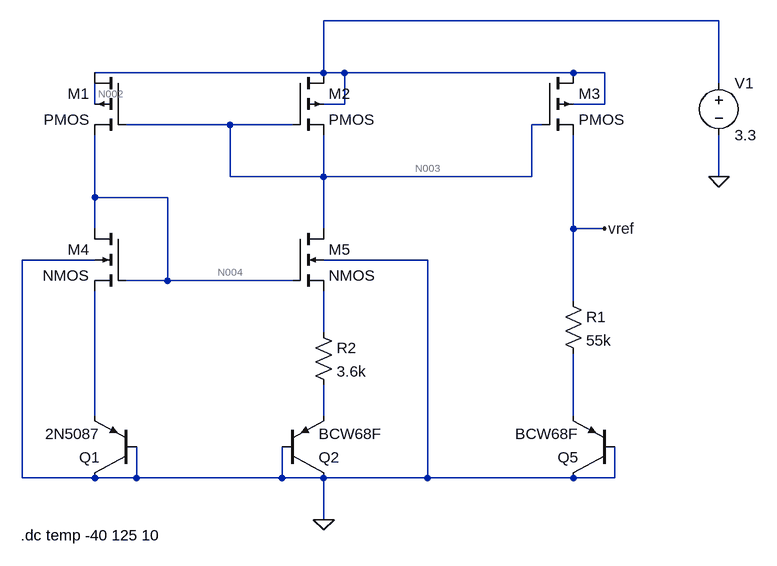
[diagram p0: schematic BGR_currentmirror.asc]
BGR_currentmirror.asc, the LTspice schematic file:
Version 4
SHEET 1 1168 720
WIRE 992 -112 384 -112
WIRE 384 -32 384 -112
WIRE 384 -32 32 -32
WIRE 416 -32 384 -32
WIRE 768 -32 416 -32
WIRE 816 -32 768 -32
WIRE 992 -16 992 -112
WIRE 32 16 32 -16
WIRE 416 16 416 -32
WIRE 416 16 384 16
WIRE 816 16 816 -32
WIRE 816 16 768 16
WIRE 240 48 80 48
WIRE 336 48 240 48
WIRE 720 48 704 48
WIRE 240 128 240 48
WIRE 384 128 384 64
WIRE 384 128 240 128
WIRE 704 128 704 48
WIRE 704 128 384 128
WIRE 992 128 992 64
WIRE 32 160 32 64
WIRE 144 160 32 160
WIRE 32 208 32 160
WIRE 384 208 384 128
WIRE 768 208 768 64
WIRE 816 208 768 208
WIRE 32 256 -80 256
WIRE 544 256 384 256
WIRE 144 288 144 160
WIRE 144 288 80 288
WIRE 336 288 144 288
WIRE 768 320 768 208
WIRE 384 368 384 304
WIRE 32 496 32 304
WIRE 384 496 384 448
WIRE 768 496 768 400
WIRE -80 592 -80 256
WIRE 32 592 -80 592
WIRE 96 592 96 544
WIRE 96 592 32 592
WIRE 320 592 320 544
WIRE 320 592 96 592
WIRE 384 592 320 592
WIRE 544 592 544 256
WIRE 544 592 384 592
WIRE 768 592 544 592
WIRE 832 592 832 544
WIRE 832 592 768 592
WIRE 384 656 384 592
FLAG 992 128 0
FLAG 384 656 0
FLAG 816 208 vref
SYMBOL pmos4 80 -32 M0
SYMATTR InstName M1
SYMATTR Value2 l=500n w=500n
SYMBOL pmos4 336 -32 R0
SYMATTR InstName M2
SYMATTR Value2 l=500n w=500n
SYMBOL pmos4 720 -32 R0
SYMATTR InstName M3
SYMATTR Value2 l=500n w=500n
SYMBOL nmos4 80 208 M0
SYMATTR InstName M4
SYMATTR Value2 l=500n w=500n
SYMBOL nmos4 336 208 R0
SYMATTR InstName M5
SYMATTR Value2 l=500n w=500n
SYMBOL pnp 96 592 R180
SYMATTR InstName Q1
SYMATTR Value 2N5087
SYMBOL pnp 832 592 R180
SYMATTR InstName Q5
SYMATTR Value BCW68F
SYMBOL res 752 304 R0
SYMATTR InstName R1
SYMATTR Value 55k
SYMBOL res 368 352 R0
SYMATTR InstName R2
SYMATTR Value 3.6k
SYMBOL voltage 992 -32 R0
SYMATTR InstName V1
SYMATTR Value 3.3
SYMBOL pnp 320 592 M180
SYMATTR InstName Q2
SYMATTR Value BCW68F
TEXT -82 680 Left 2 !.dc temp -40 125 10

The netlist it stands for:
* BGR_currentmirror.asc
M1 N001 N003 N004 N002 PMOS l=500n w=500n
M2 N001 N003 N003 N001 PMOS l=500n w=500n
M3 N001 N003 vref N001 PMOS l=500n w=500n
M4 N004 N004 N006 0 NMOS l=500n w=500n
M5 N003 N004 N005 0 NMOS l=500n w=500n
Q1 0 0 N006 0 2N5087
Q5 0 0 N008 0 BCW68F
R1 vref N008 55k
R2 N005 N007 3.6k
V1 N001 0 3.3
Q2 0 0 N007 0 BCW68F
.model NPN NPN
.model PNP PNP
.lib standard.bjt
.model NMOS NMOS
.model PMOS PMOS
.lib standard.mos
.dc temp -40 125 10
.backanno
.end

* Results of the author's LTspice run, read from the files saved beside the schematic
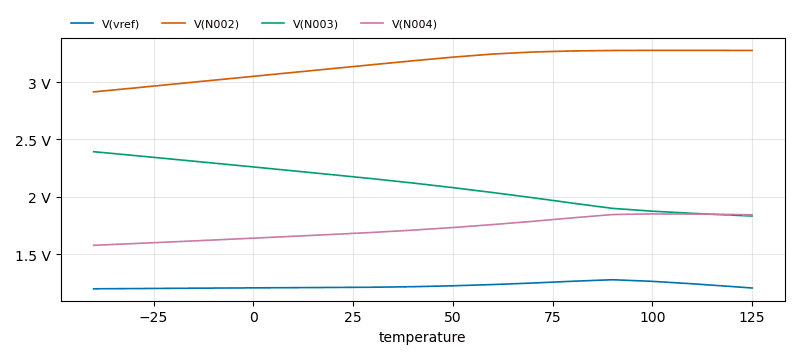
[diagram p1: DC transfer characteristic of BGR_currentmirror.asc, plotted from the saved traces]
* DC transfer characteristic, 1 run:
*   V(vref): 1.198 V at temperature=-40 , 1.205 V at temperature=125 , min 1.198 V, max 1.277 V
*   V(N002): 2.915 V at temperature=-40 , 3.276 V at temperature=125 , min 2.915 V, max 3.277 V
*   V(N003): 2.393 V at temperature=-40 , 1.833 V at temperature=125 , min 1.833 V, max 2.393 V
*   V(N004): 1.577 V at temperature=-40 , 1.844 V at temperature=125 , min 1.577 V, max 1.851 V